# Altium schematic sheet MCU-Power.SchDoc: =ProjectDescription
size 297 x 209 mm; Address1: Address1; Address2: Address2; Address3: Address3; Address4: Address4; SheetNumber: 2; SheetTotal: 7; Scale: 1:1; DocumentType: Схема электрическая принципиальная
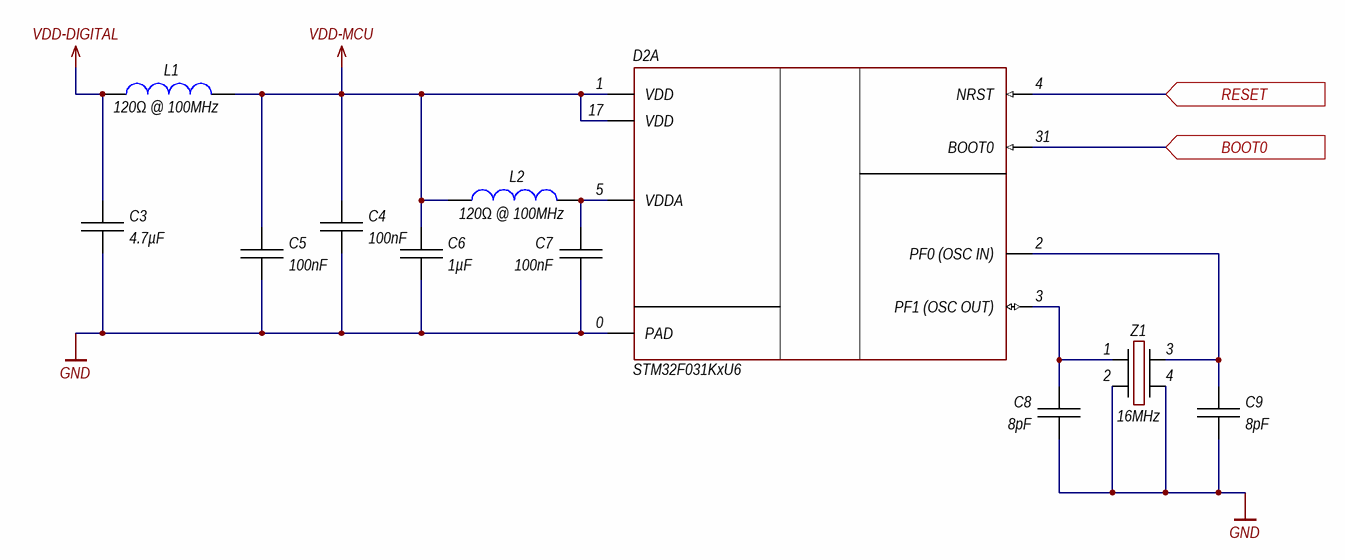
[diagram p0: MCU-Power.SchDoc]

## Parts
C3  4.7µF  [CH0402C]
C4  100nF  [CH0402C]
C5  100nF  [CH0402C]
C6  1µF  [CH0402C]
C7  100nF  [CH0402C]
C8  8pF  [CH0402C]
C9  8pF  [CH0402C]
D2  STM32F031KxU6  [32-UFQFPN]  (part A of 2)
L1  120Ω @ 100MHz  [CH0402L]
L2  120Ω @ 100MHz  [CH0402L]
Z1  16MHz  [OSC: 2520]

## Ports
BOOT0 (in), RESET (in)

## Nets
GND: C3.1 C4.1 C5.1 C6.1 C7.1 C8.1 C9.1 D2.0(PAD) Z1.2 Z1.4
VDD-DIGITAL: C3.2 L1.2
VDD-MCU: C4.2 C5.2 C6.2 D2.1(VDD) D2.17(VDD) L1.1 L2.2
BOOT0: D2.31(BOOT0) ; port BOOT0
RESET: D2.4(NRST) ; port RESET
NetC7_2: C7.2 D2.5(VDDA) L2.1
NetC8_2: C8.2 D2.3(PF1_(OSC_OUT)) Z1.1
NetC9_2: C9.2 D2.2(PF0_(OSC_IN)) Z1.3

## Notes on the sheet
- Изм.
- Лист
- № докум.
- Подп.
- Дата
- Копировал
- Формат А4

## Library data of the parts
C3-C9 = Capacitor: Manufacturer: *; Model: *; HelpURL: *; ComponentKind: *
  C3: Value: 4.7µF
  C4 C5 C7: Value: 100nF
  C6: Value: 1µF
  C8 C9: Value: 8pF
D2 = STM32F031KxU6: STM32, Cortex-M0; Manufacturer: ST Microelectronics; Model: STM32F031KxU6; ComponentKind: STM32, 2.0-3.6V, 32-UFQFPN; HelpURL: https://lcsc.com/product-detail/ST-Microelectronics_STMicroelectronics-STM32F031K6U6_C97412.html
L1 L2 = Inductor: Manufacturer: *; Model: *; HelpURL: *; ComponentKind: *; Value: 120Ω @ 100MHz
Z1 = Generator: Manufacturer: *; Model: *; HelpURL: *; ComponentKind: *; Value: 16MHz